# Altium schematic sheet controller.SchDoc
size A4; SheetNumber: 3; SheetTotal: 8
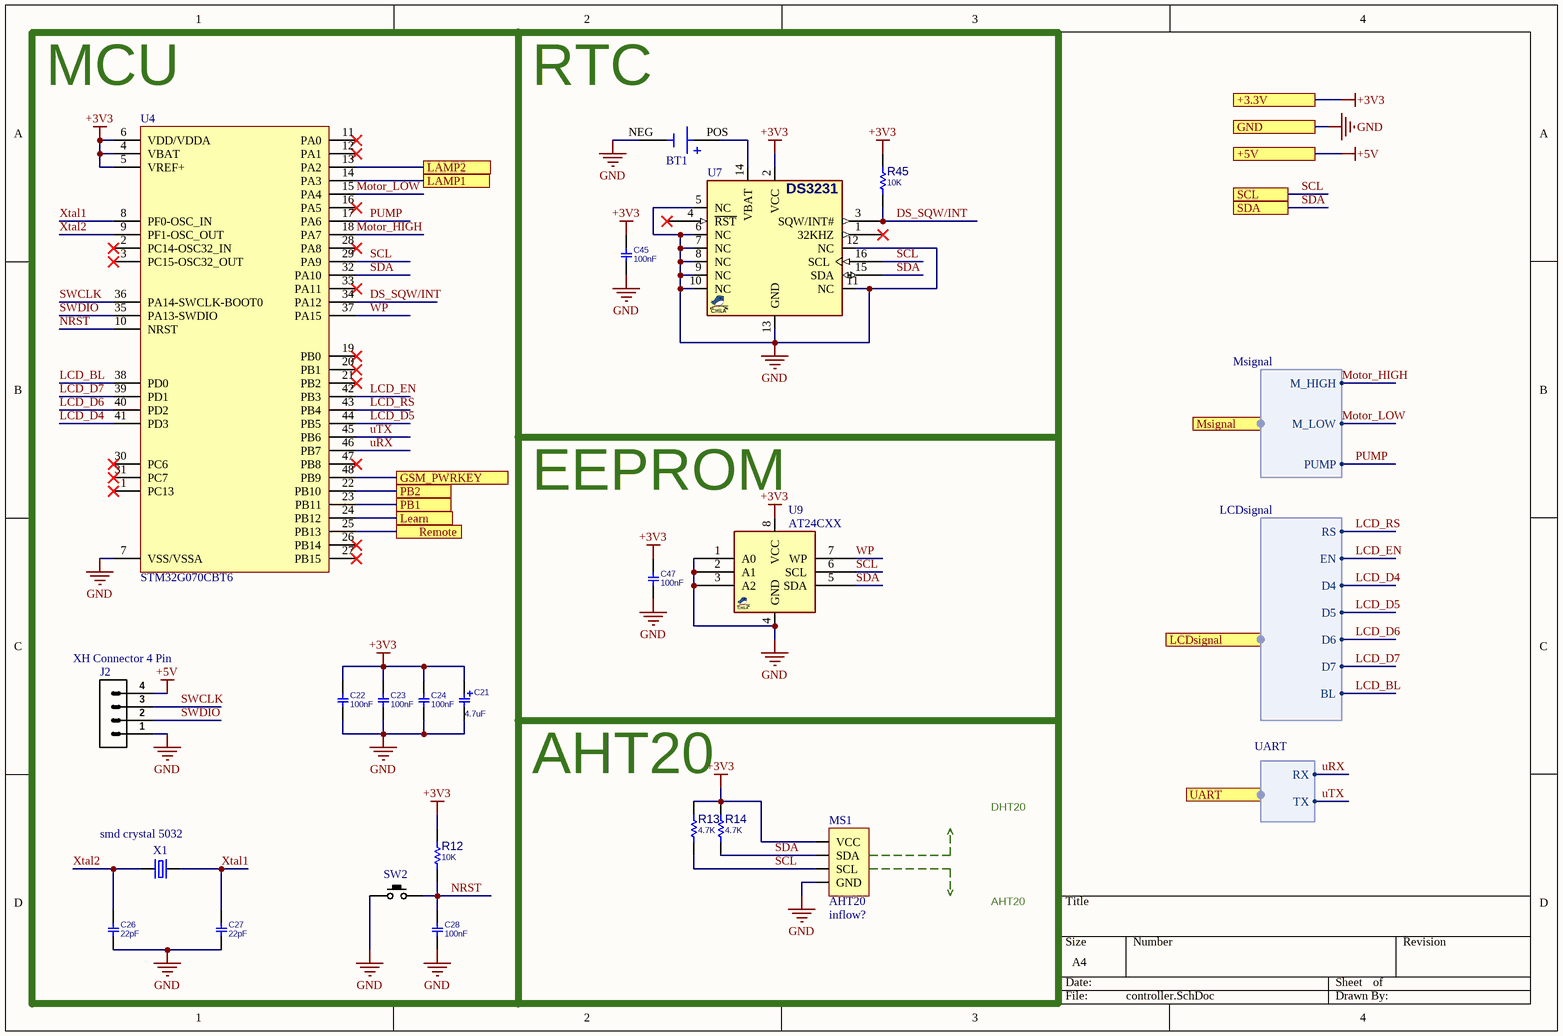
[diagram p0: controller.SchDoc]

## Parts
BT1  Coin Cell battery holder  [Coin Cell battery holder]  (value not drawn)
C21  4.7uF  [C_TN_3216]
C22  100nF  [C0805]
C23  100nF  [C0805]
C24  100nF  [C0805]
C26  22pF  [C0805]
C27  22pF  [C0805]
C28  100nF  [C0805]
C45  100nF  [C0805]
C47  100nF  [C0805]
J2  XH Connector 4 Pin  [XH 4 Pin - 2.5mm]
MS1  Inflow: inflow?  [AHT20]  (hidden comment: AHT20)
R12  10K  [R0805]
R13  4.7K  [R0805]
R14  4.7K  [R0805]
R45  10K  [R0805]
SW2  Tactile Switch  [Tactile Switch]  (value not drawn)
U4  STM32G070CBT6  [STM32G070CBT6]
U7  DS3231  [SO_16_W]  (value not drawn)
U9  AT24CXX  [SO_8]
X1  smd crystal 5032  [smd crystal 5032]

## Blocks framed on the sheet
MCU: C21-C24 C26-C28 J2 R12 SW2 U4 X1

## Ports
+3.3V, +5V, GND, GSM_PWRKEY, LAMP1, LAMP2, LCDsignal (harness LCDsignal), Learn, Msignal (harness Msignal), PB1, PB2, Remote, SCL, SDA, UART (harness UART)

## Harnesses
Msignal: M_HIGH, M_LOW, PUMP
LCDsignal: RS, EN, D4, D5, D6, D7, BL
UART: RX, TX

## Nets
+3V3: C21.1 C22.2 C23.2 C24.2 C45.2 C47.2 MS1.4(VCC) R12.1 R13.1 R14.1 R45.1 U4.4(VBAT) U4.5(VREF+) U4.6(VDD/VDDA) U7.2(VCC) U9.8(VCC) ; port +3.3V
+5V: J2.4 ; port +5V
GND: BT1.NEG C21.2 C22.1 C23.1 C24.1 C26.2 C27.2 C28.1 C45.1 C47.1 J2.1 MS1.3(GND) SW2.1(P1) U4.7(VSS/VSSA) U7.5(NC) U7.6(NC) U7.7(NC) U7.8(NC) U7.9(NC) U7.10(NC) U7.11(NC) U7.12(NC) U7.13(GND) U9.1(A0) U9.2(A1) U9.3(A2) U9.4(GND) ; port GND
DS_SQW/INT: R45.2 U4.34(PA12) U7.3(SQW/INT#)
GSM_PWRKEY: U4.48(PB9) ; port GSM_PWRKEY
LAMP1: U4.14(PA3) ; port LAMP1
LAMP2: U4.13(PA2) ; port LAMP2
LCD_BL: U4.38(PD0) ; port LCDsignal.BL
LCD_D4: U4.41(PD3) ; port LCDsignal.D4
LCD_D5: U4.44(PB5) ; port LCDsignal.D5
LCD_D6: U4.40(PD2) ; port LCDsignal.D6
LCD_D7: U4.39(PD1) ; port LCDsignal.D7
LCD_EN: U4.42(PB3) ; port LCDsignal.EN
LCD_RS: U4.43(PB4) ; port LCDsignal.RS
Learn: U4.24(PB12) ; port Learn
Motor_HIGH: U4.18(PA7) ; port Msignal.M_HIGH
Motor_LOW: U4.15(PA4) ; port Msignal.M_LOW
NRST: C28.2 R12.2 SW2.2(P3) U4.10(NRST)
PB1: U4.23(PB11) ; port PB1
PB2: U4.22(PB10) ; port PB2
PUMP: U4.17(PA6) ; port Msignal.PUMP
Remote: U4.25(PB13) ; port Remote
SCL: MS1.2(SCL) R13.2 U4.29(PA9) U7.16(SCL) U9.6(SCL) ; port SCL
SDA: MS1.1(SDA) R14.2 U4.32(PA10) U7.15(SDA) U9.5(SDA) ; port SDA
SWCLK: J2.3 U4.36(PA14-SWCLK-BOOT0)
SWDIO: J2.2 U4.35(PA13-SWDIO)
uRX: U4.46(PB7) ; port UART.RX
uTX: U4.45(PB6) ; port UART.TX
WP: U4.37(PA15) U9.7(WP)
Xtal1: C27.1 U4.8(PF0-OSC_IN) X1.2
Xtal2: C26.1 U4.9(PF1-OSC_OUT) X1.1
NetBT1_POS: BT1.POS U7.14(VBAT)

Not connected (* = marked no-connect by the designer): U4 1(PC13)* 2(PC14-OSC32_IN)* 3(PC15-OSC32_OUT)* 11(PA0)* 12(PA1)* 16(PA5)* 19(PB0)* 20(PB1)* 21(PB2)* 26(PB14)* 27(PB15)* 28(PA8)* 30(PC6)* 31(PC7)* 33(PA11)* 47(PB8)*; U7 1(32KHZ)* 4(~{RST})*

## Notes on the sheet
- RTC
- (near U9) EEPROM
- AHT20
- DHT20

## Library data of the parts
BT1 = Coin Cell battery holder: 2032 Battery
C21 = CAP_SMD_TAN: CAP, SMD, TAN,; PARAM2: -V; VALUE: 4.7uF
C22-C24 C28 C45 C47 = CAP_SMD_MLCC_0805: CAP, MLCC, -F, -V, MATERIAL, -%, 0201; PARAM: -, -%; MANF_P#: MANF_PART#; PRICE: 100= 1$; MANF: -; PARAM2: -V; ASSEMBLY: ASSEMBLY; VALUE: 100nF
C26 C27 = CAP_SMD_MLCC_0805: CAP, MLCC, -F, -V, MATERIAL, -%, 0201; PARAM: -, -%; MANF_P#: MANF_PART#; VALUE: 100nF; PRICE: 100= 1$; MANF: -; PARAM2: -V; ASSEMBLY: ASSEMBLY
J2 = XH 4: XH, 4-Pin; Current: 3A; Library Link: https://github.com/Majid-Derhambakhsh; Publisher: Majid Derhambakhsh
MS1 = ModSen_AHT20: Air Temperature and Humidity Sensor; Rating: Rating?; Validation: NT; Package: Dip; Type: Air T&H; Value: AHT20
R12-R14 R45 = RES_SMD_0805: RESISTOR, SMD; PARAM: -W; DESC: DESCRIPTION; DIST#: MOUSER; PARAM2: 1%; MANF_P#: -; MANF: -; ASSEMBLY: ASSEMBLY; PRICE: 100= 0.5$
  R12 R45: VALUE: 10K
  R13 R14: VALUE: 4.7K
SW2 = Tactile Switch: 3x6x5 mm - 2 Pin
U4 = STM32G070CBT6: ARMÂ® CortexÂ®-M0+ STM32G0 Microcontroller IC 32-Bit 64MHz 128KB _128K x 8_ FLASH 48-LQFP _7x7_
U7 = DS3231_SOP16W: Real-Time Clock, I2C, +IntCryst; MANF: Maxim Integrated; MANF_P#: DS3231SN#; PARAM2: 2.3~5.5V; PARAM: I2C, +IntCryst, -40~85°C; VALUE: DS3231; PRICE: 10$
U9 = EEPROM_I2C_AT24CXX_SOP8: EEPROM, I2C,; Value: AT24CXX
X1 = smd crystal 5032: 8Mhz - 2Pin - 5032 Package